# EAGLE design SIM900-SMS-Relay-Controller (EAGLE 6.3)
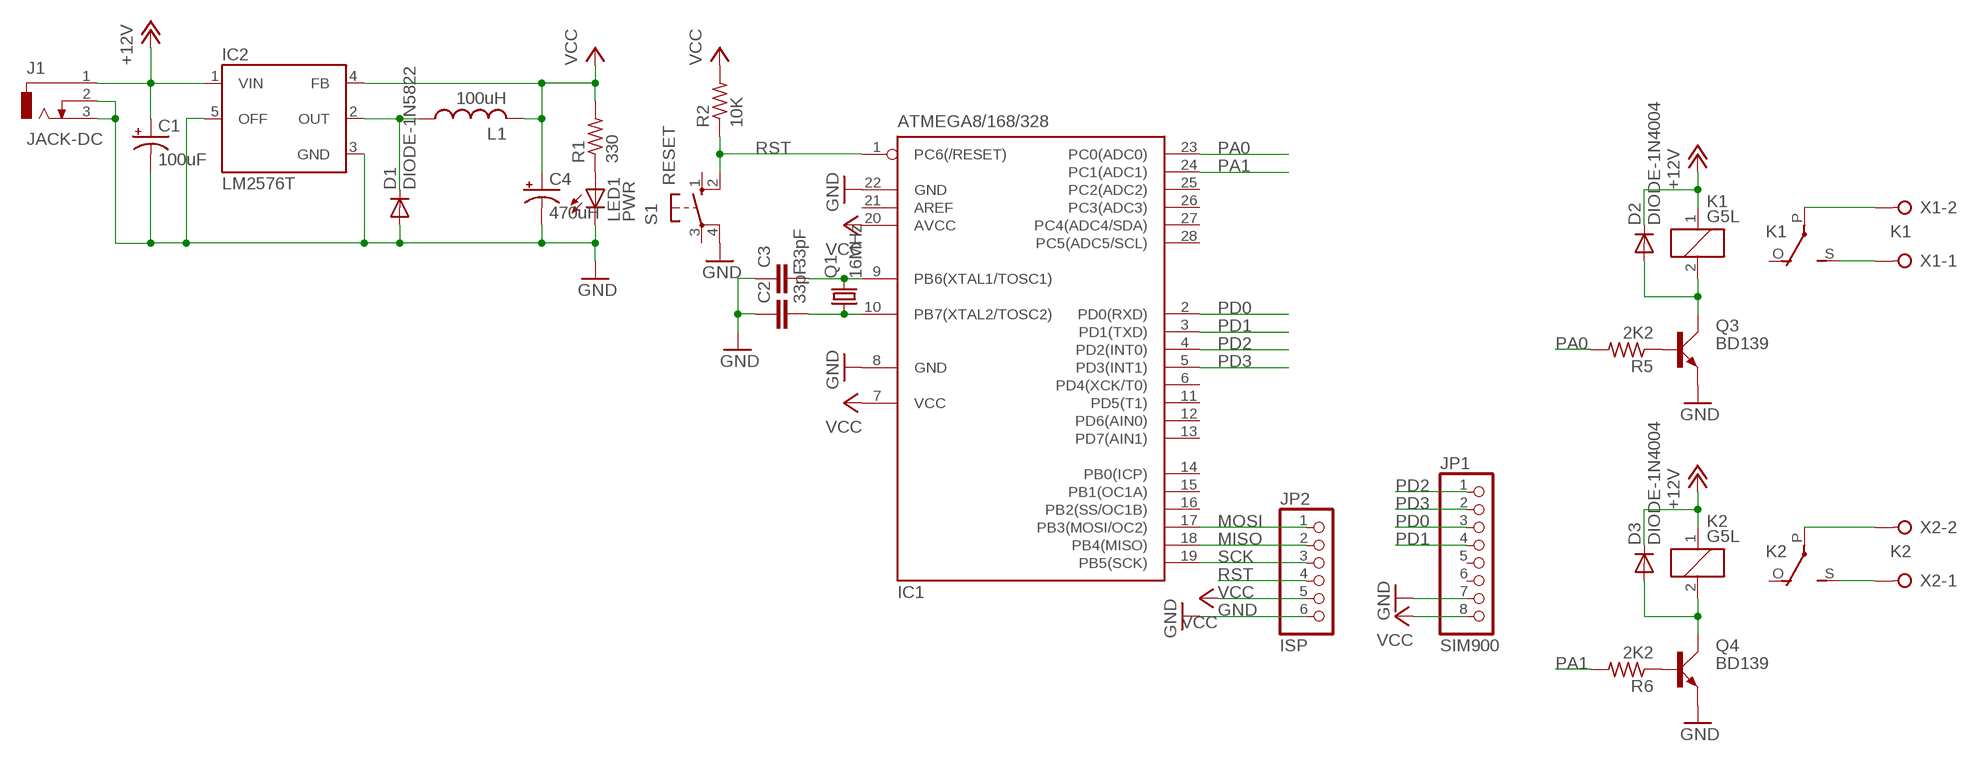
[diagram p0: schematic, sheet 1]

## Parts
C1  100uF  CAPACITOR-POLARE2.5-6  [E2,5-6]
C2  33pF  CAPACITOR-NONPOLAR025-024X044  [C025-024X044]
C3  33pF  CAPACITOR-NONPOLAR025-024X044  [C025-024X044]
C4  470uH  CAPACITOR-POLARE3.5-8  [E3,5-8]
D1  DIODE-1N5822  [DO201-15]
D2  DIODE-1N4004  [DO41-10]
D3  DIODE-1N4004  [DO41-10]
IC1  ATMEGA8/168/328  [DIL28-3]
IC2  LM2576T  [TO220-5]
J1  JACK-DC  [DCJ0202]
JP1  SIM900  PINHD-1X8  [1X08]
JP2  ISP  PINHD-1X6  [1X06]
K1  G5L  [G5LE]
K2  G5L  [G5LE]
L1  100uH  INDUCTORTJ3-U2  [TJ3-U2]
LED1  PWR  LED3MM  [LED3MM]
Q1  16MHz  CRYSTALHC49S  [HC49/S]
Q3  BD139  [TO126AV]
Q4  BD139  [TO126AV]
R1  330  RESISTOR0207/10  [0207/10]
R2  10K  RESISTOR0207/10  [0207/10]
R5  2K2  RESISTOR0207/10  [0207/10]
R6  2K2  RESISTOR0207/10  [0207/10]
S1  RESET  SW-PUSHBUTTON  [B3F-10XX]
X1  K1  W237-02P  [W237-132]
X2  K2  W237-02P  [W237-132]

## Nets
+12V: C1.+ D2.C D3.C IC2.1(VIN) J1.1 K1.1 K2.1
GND: C1.- C2.1 C3.1 C4.- D1.A IC1.8(GND) IC1.22(GND) IC2.3(GND) IC2.5(OFF) J1.2 J1.3 JP1.7 JP2.6 LED1.K(C) Q3.E Q4.E S1.4(P1)
MISO: IC1.18(PB4(MISO)) JP2.2
MOSI: IC1.17(PB3(MOSI/OC2)) JP2.1
N$1: C3.2 IC1.9(PB6(XTAL1/TOSC1)) Q1.2
N$2: C2.2 IC1.10(PB7(XTAL2/TOSC2)) Q1.1
N$3: K1.S(2:S) X1.1
N$6: D1.C IC2.2(OUT) L1.1
N$9: Q3.B R5.1
N$10: LED1.A R1.1
N$11: Q4.B R6.1
N$14: D2.A K1.2 Q3.C
N$15: D3.A K2.2 Q4.C
N$17: K1.P(2:P) X1.2
N$18: K2.S(2:S) X2.1
N$19: K2.P(2:P) X2.2
PA0: IC1.23(PC0(ADC0)) R5.2
PA1: IC1.24(PC1(ADC1)) R6.2
PD0: IC1.2(PD0(RXD)) JP1.3
PD1: IC1.3(PD1(TXD)) JP1.4
PD2: IC1.4(PD2(INT0)) JP1.1
PD3: IC1.5(PD3(INT1)) JP1.2
RST: IC1.1(PC6(/RESET)) JP2.4 R2.1 S1.2(S1)
SCK: IC1.19(PB5(SCK)) JP2.3
VCC: C4.+ IC1.7(VCC) IC1.20(AVCC) IC2.4(FB) JP1.8 JP2.5 L1.2 R1.2 R2.2
Unconnected: IC1.6(PD4(XCK/T0)) IC1.11(PD5(T1)) IC1.12(PD6(AIN0)) IC1.13(PD7(AIN1)) IC1.14(PB0(ICP)) IC1.15(PB1(OC1A)) IC1.16(PB2(SS/OC1B)) IC1.21(AREF) IC1.25(PC2(ADC2)) IC1.26(PC3(ADC3)) IC1.27(PC4(ADC4/SDA)) IC1.28(PC5(ADC5/SCL)) JP1.5 JP1.6 K1.O(2:O) K2.O(2:O) S1.1(S) S1.3(P)

## Library data of the parts
C1 C4 = barelang-store:CAPACITOR-POLAR: POLARIZED CAPACITOR, American symbol
C2 C3 = barelang-store:CAPACITOR-NONPOLAR: CAPACITOR, European symbol
D1 = barelang-store:DIODE-1N5822: DIODE standard rectifier, 3 A, 50 V (Motorola)
D2 D3 = barelang-store:DIODE-1N4004: DIODE general purpose rectifier, 1 A
IC1 = barelang-store:ATMEGA8/168/328: MICROCONTROLLER 8 Kbytes FLASH, 1 kbytes SRAM, 512 bytes EEPROM, USART, 4-channel 10 bit ADC, 2-channel 8 bit ADC Pin compatible with Atmega48, ATMega88, ATMega168 Source: avr.lbr; OC_FARNELL: unknown; OC_NEWARK: unknown
IC2 = barelang-store:LM2576: National Semiconductor <http://www.national.com> 3.0A "Simple Switcher"(c) 52kHz, Vout 1.23-37V (HV: 57V), Vin 40V (HV: 60V), 50µA standby current
J1 = barelang-store:JACK-DC: DC POWER JACK Source: DCJ0202.pdf; OC_FARNELL: unknown; OC_NEWARK: unknown
JP1 = barelang-store:PINHD-1X8: PIN HEADER
JP2 = barelang-store:PINHD-1X6: PIN HEADER
K1 K2 = relay:G5L: RELAY 1 x switch, 10 A/120 V AC, 8 A/30 V ADC, Omron; OC_FARNELL: unknown; OC_NEWARK: unknown
L1 = barelang-store:INDUCTOR: INDUCTOR, American symbol
LED1 = barelang-store:LED: LED OSRAM: - CHIPLED LG R971, LG N971, LY N971, LG Q971, LY Q971, LO R971, LY R971 LH N974, LH R974 LS Q976, LO Q976, LY Q976 LO Q996 - Hyper CHIPLED LW Q18S LB Q993, LB Q99A, LB R99A - SideLED LS A670, LO A670, LY A670, LG A670, LP A670 LB A673, LV A673, LT A673, LW A673 LH A674 LY A675 LS A676, LA A676, LO A676, LY A676, LW A676 LS A679, LY A679, LG A679 - Hyper Micro SIDELED® LS Y876, LA Y876, LO Y876, LY Y876 LT Y87S - SmartLED LW L88C, LW L88S LB L89C, LB L89S, LG L890 LS L89K, LO L89K, LY L89K LS L896, LA L896, LO L896, LY L896 - TOPLED LS T670, LO T670, LY T670, LG T670, LP T670 LSG T670, LSP T670, LSY T670, LOP T670, LYG T670 LG T671, LOG T671, LSG T671 LB T673, LV T673, LT T673, LW T673 LH T674 LS T676, LA T676, LO T676, LY T676, LB T676, LH T676, LSB T676, LW T676 LB T67C, LV T67C, LT T67C, LS T67K, LO T67K, LY T67K, LW E67C LS E67B, LA E67B, LO E67B, LY E67B, LB E67C, LV E67C, LT E67C LW T67C LS T679, LY T679, LG T679 LS T770, LO T770, LY T770, LG T770, LP T770 LB T773, LV T773, LT T773, LW T773 LH T774 LS E675, LA E675, LY E675, LS T675 LS T776, LA T776, LO T776, LY T776, LB T776 LHGB T686 LT T68C, LB T68C - Hyper Mini TOPLED® LB M676 - Mini TOPLED Santana® LG M470 LS M47K, LO M47K, LY M47K Source: http://www.osram.convergy.de LUXEON: - LUMILED® LXK2-PW12-R00, LXK2-PW12-S00, LXK2-PW14-U00, LXK2-PW14-V00 LXK2-PM12-R00, LXK2-PM12-S00, LXK2-PM14-U00 LXK2-PE12-Q00, LXK2-PE12-R00, LXK2-PE12-S00, LXK2-PE14-T00, LXK2-PE14-U00 LXK2-PB12-K00, LXK2-PB12-L00, LXK2-PB12-M00, LXK2-PB14-N00, LXK2-PB14-P00, LXK2-PB14-Q00 LXK2-PR12-L00, LXK2-PR12-M00, LXK2-PR14-Q00, LXK2-PR14-R00 LXK2-PD12-Q00, LXK2-PD12-R00, LXK2-PD12-S00 LXK2-PH12-R00, LXK2-PH12-S00 LXK2-PL12-P00, LXK2-PL12-Q00, LXK2-PL12-R00 Source: www.luxeon.com KINGBRIGHT: KA-3528ASYC Source: www.kingbright.com
Q1 = barelang-store:CRYSTAL: CRYSTAL; OC_FARNELL: 1667008; OC_NEWARK: unknown
Q3 Q4 = barelang-store:BD139: NPN TRANSISTOR
R1 R2 R5 R6 = barelang-store:RESISTOR: RESISTOR, American symbol
S1 = barelang-store:SW-PUSHBUTTON: OMRON SWITCH; MPN: B3F-1000; OC_FARNELL: 176432; OC_NEWARK: 36M3542
X1 X2 = con-wago-508:W237-02P: WAGO SREW CLAMP; OC_FARNELL: unknown; OC_NEWARK: unknown

## Board
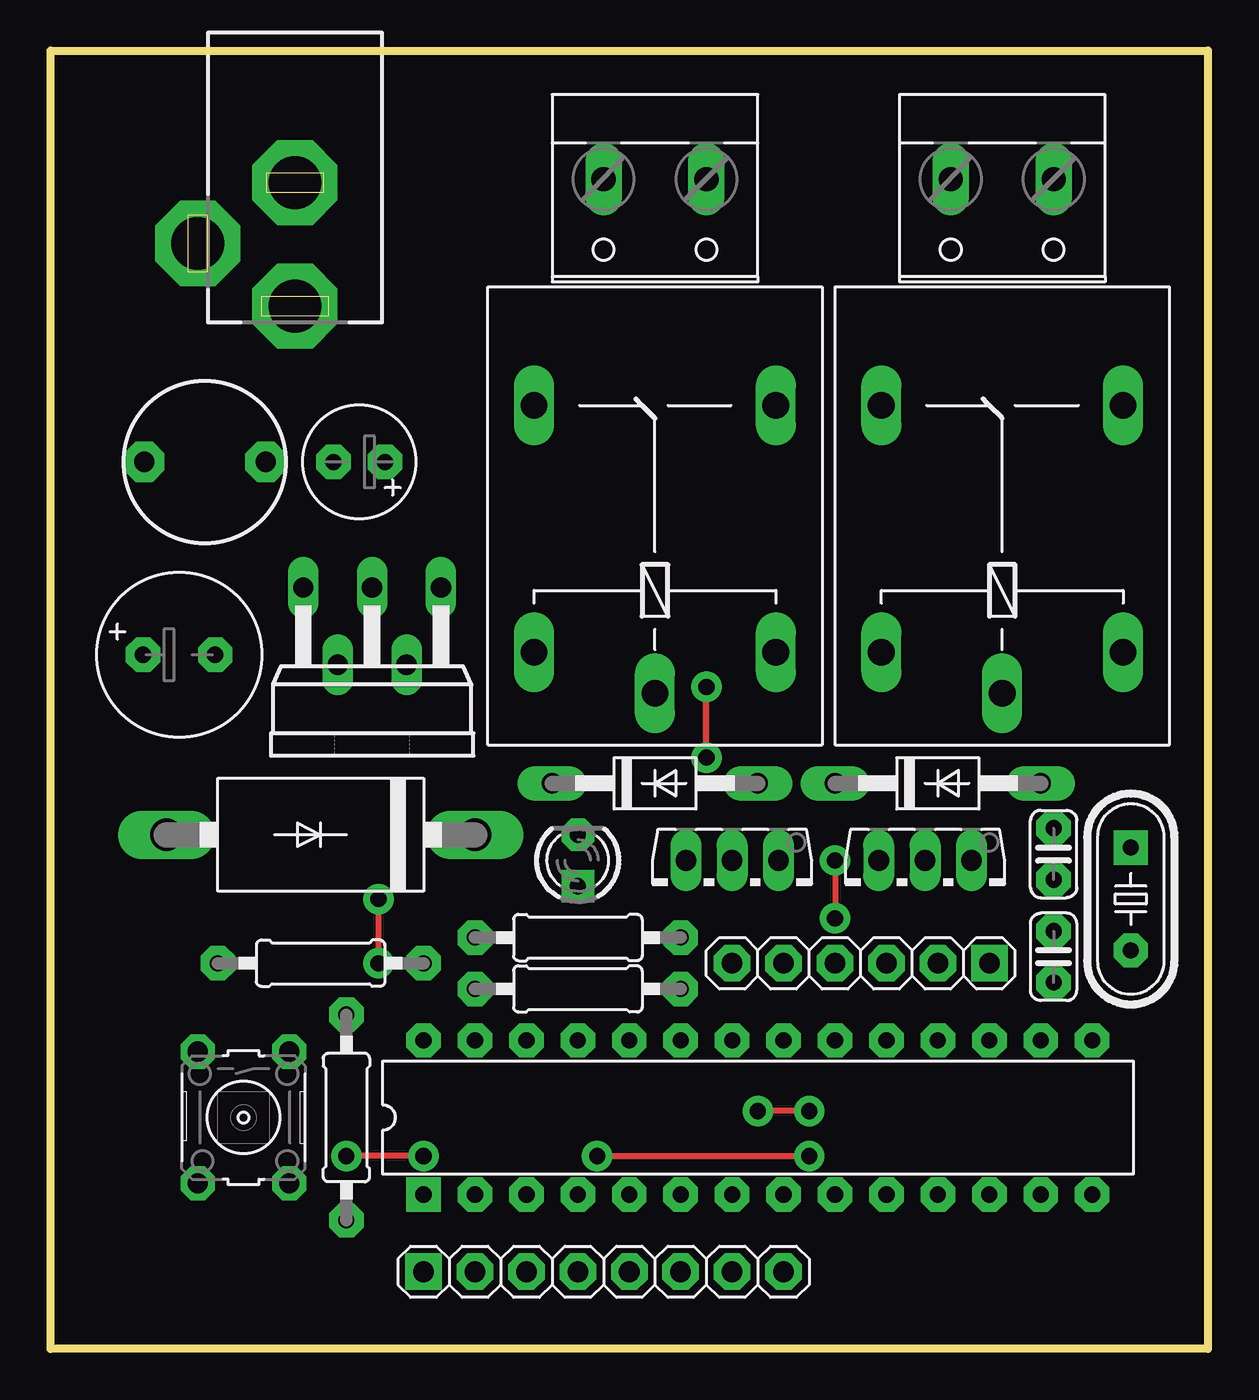
[diagram p1: board, top side]
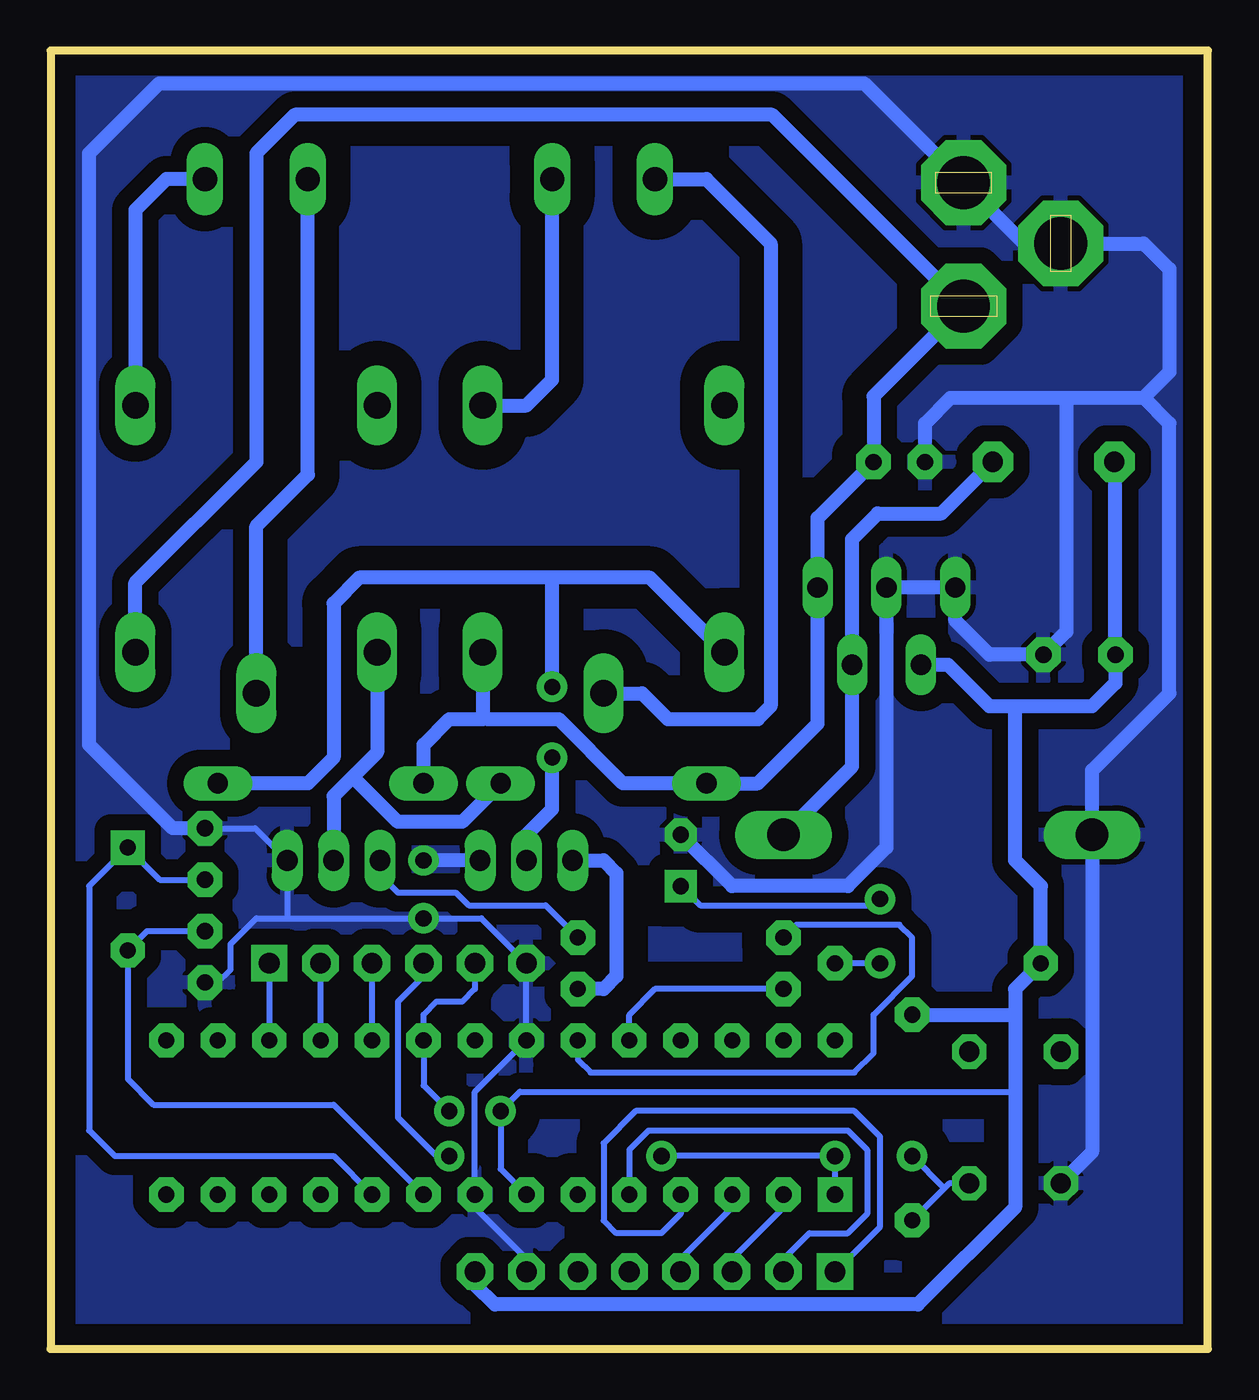
[diagram p2: board, bottom side, seen from below]

Size 57.15 x 64.14 mm. Coordinates in mm from the lower left corner, seen from the top.
Outline: 0,64.14 57.15,64.14 57.15,0 0,0 0,64.14
Copper layers (1*16): Top 0.035mm / dielectric 1.5mm / Bottom 0.035mm
Design rules "default *": minimum track width 0.3mm, minimum drill 0.8mm, track to track 10mil, track to pad 10mil, pad to pad 10mil, via to via 10mil, smd to smd 8mil, copper to edge 40mil, drill to drill 8mil, minimum pad ring 10mil, minimum via ring 8mil, stop-mask expansion 4mil, vias tented up to drill 0mil, thermal gap 10mil

### Footprints (pad centres in the part's own frame; a part is rotated, then mirrored left to right if it is on the bottom)
E2,5-6 = drill 0.8 pad 1.7 octagon: + -1.27,0; - 1.27,0
C025-024X044 = drill 0.8 pad 1.7 octagon: 1 -1.27,0; 2 1.27,0
E3,5-8 = drill 0.813 pad 1.7 octagon: + -1.778,0; - 1.778,0
DO201-15 = drill 1.6 long: A 7.62,0; C -7.62,0
DO41-10 = drill 1 pad 1.7 long: A 5.08,0; C -5.08,0
DIL28-3 = drill 0.8 pad 1.7 square: 1 -16.51,-3.81 | drill 0.8 pad 1.7 octagon: 2 -13.97,-3.81; 3 -11.43,-3.81; 4 -8.89,-3.81; 5 -6.35,-3.81; 6 -3.81,-3.81; 7 -1.27,-3.81; 8 1.27,-3.81; 9 3.81,-3.81; 10 6.35,-3.81; 11 8.89,-3.81; 12 11.43,-3.81; 13 13.97,-3.81; 14 16.51,-3.81; 15 16.51,3.81; 16 13.97,3.81; 17 11.43,3.81; 18 8.89,3.81; 19 6.35,3.81; 20 3.81,3.81; 21 1.27,3.81; 22 -1.27,3.81; 23 -3.81,3.81; 24 -6.35,3.81; 25 -8.89,3.81; 26 -11.43,3.81; 27 -13.97,3.81; 28 -16.51,3.81
TO220-5 = drill 1 long: 1 -3.4,-8.4; 2 -1.7,-4.59; 3 0,-8.4; 4 1.7,-4.59; 5 3.4,-8.4
DCJ0202 = drill 2.6 pad 4.2 octagon: 1 0,3.1; 2 4.8,0; 3 0,-3
1X08 = drill 1.016 pad 1.8 square: 1 -8.89,0 | drill 1.016 pad 1.8 octagon: 2 -6.35,0; 3 -3.81,0; 4 -1.27,0; 5 1.27,0; 6 3.81,0; 7 6.35,0; 8 8.89,0
1X06 = drill 1.016 pad 1.8 square: 1 -6.35,0 | drill 1.016 pad 1.8 octagon: 2 -3.81,0; 3 -1.27,0; 4 1.27,0; 5 3.81,0; 6 6.35,0
G5LE = drill 1.321 long: 1 -7.493,-5.969; 2 -7.493,5.969; O 4.699,5.969; P -9.525,0; S 4.699,-5.969
TJ3-U2 = drill 1 pad 2 octagon: 1 -3,0; 2 3,0
LED3MM = drill 0.8 pad 1.6 square: A -1.27,0 | drill 0.8 pad 1.6 octagon: K 1.27,0
HC49/S = drill 0.8 pad 1.7 square: 1 -2.54,0 | drill 0.8 pad 1.7 octagon: 2 2.54,0
TO126AV = drill 1.016 long: B 2.286,-1.27; C 0,-1.27; E -2.286,-1.27
0207/10 = drill 0.8 pad 1.7 octagon: 1 -5.08,0; 2 5.08,0
B3F-10XX = drill 1 pad 1.7 octagon: 1 -3.251,2.261; 2 3.251,2.261; 3 -3.251,-2.261; 4 3.251,-2.261
W237-132 = drill 1.194 long: 1 -2.54,-0.635; 2 2.54,-0.635

### Placement (x,y rotation side)
C1  15.24,43.81 180 top
C2  49.53,24.45 270 top
C3  49.53,19.37 90 top
C4  6.35,34.29 0 top
D1  13.34,25.4 180 top
D2  29.85,27.94 0 top
D3  43.81,27.94 0 top
IC1  34.93,11.43 0 top
IC2  15.88,29.21 180 top
J1  12.07,54.61 180 top
JP1  27.3,3.81 0 top
JP2  40.01,19.05 180 top
K1  46.99,41.91 90 top
K2  29.85,41.91 90 top
L1  7.62,43.81 180 top
LED1  26.04,24.13 90 top
Q1  53.34,22.23 270 top
Q3  43.18,22.86 180 top
Q4  33.66,22.86 180 top
R1  13.34,19.05 180 top
R2  14.61,11.43 90 top
R5  26.04,20.32 180 top
R6  26.04,17.78 180 top
S1  9.53,11.43 270 top
X1  46.99,57.15 180 top
X2  29.85,57.15 180 top

### Tracks (layer width: path | path; a pad name or v marks a point on that pad's centre or on a via)
+12V
  Bottom 0.3: 35.81,31.12 35.56,31.12
  Bottom 0.7: K1.1 52.96,37.85 46.99,43.81 46.99,59.06 45.09,60.96 21.52,60.96 J1.1 16.51,47.06 C1.+ 19.28,41.05 IC2.1 19.28,30.89 22.23,27.94 D2.C 28.89,27.94 32.07,31.12 35.56,31.12 | D3.C 38.73,29.84 37.47,31.12 35.81,31.12 K2.1
GND  (via drill 0.8 pad 1.5)
  Top 0.3: v38.73,24.13 v38.73,21.27
  Bottom 0.3: 45.47,21.27 46.99,21.27 48.26,20 48.26,18.73 48.9,18.1 C3.1 | 45.47,21.27 v38.73,21.27 35.88,21.27 JP2.6 IC1.22 36.2,12.7 IC1.8 36.2,6.98 33.66,4.45 JP1.7 | C2.1 47.05,25.72 Q3.E 45.47,21.27
  Bottom 0.7: LED1.K 23.5,22.86 17.78,22.86 15.88,24.77 IC2.3 IC2.5 12.48,35.97 10.8,34.29 C4.- 6.98,35.43 6.98,46.99 | C2.1 51.12,25.72 55.25,29.84 55.25,59.06 51.78,62.52 16.98,62.52 J1.3 9.07,54.61 J1.2 3.18,54.61 1.91,53.34 1.91,48.26 3.18,46.99 | 3.18,46.99 1.91,45.72 1.91,32.38 5.72,28.58 D1.A 5.72,9.73 S1.4 | C1.- 13.97,45.72 12.7,46.99 6.98,46.99 | 6.98,46.99 3.18,46.99 | Q4.E v38.73,24.13
  pour Bottom (isolate 0.8): 0,0 57.15,0 57.15,64.14 0,64.14
MISO
  Bottom 0.3: IC1.18 JP2.2
MOSI
  Bottom 0.3: JP2.1 IC1.17
N$1
  Bottom 0.3: IC1.9 43.18,12.06 52.07,12.06 53.34,13.34 Q1.2 52.39,20.64 C3.2
N$2
  Bottom 0.3: IC1.10 43.18,9.52 53.98,9.52 55.25,10.8 55.25,22.86 Q1.1 51.75,23.18 C2.2
N$3
  Bottom 0.7: X1.1 51.44,57.78 52.96,56.26 K1.S
N$4
  pour Bottom (isolate 1.2): 0,0 57.15,0 57.15,64.14 0,64.14
N$6
  Bottom 0.7: L1.1 13.16,41.28 16.3,41.28 17.58,40.01 IC2.2 17.58,28.78 D1.C
N$9
  Bottom 0.3: Q3.B 40.89,23.43 40.01,22.54 37.15,22.54 36.51,21.91 32.7,21.91 R5.1
N$10  (via drill 0.8 pad 1.5)
  Top 0.3: v16.19,19.05 v16.19,22.23
  Bottom 0.3: v16.19,19.05 R1.1 | LED1.A 25.08,21.91 16.51,21.91 v16.19,22.23
N$11
  Bottom 0.7: Q4.B 29.85,24.13 29.21,23.49 29.21,18.41 29.85,17.78 R6.1
N$14
  Bottom 0.7: D2.A 36.83,26.04 40.01,26.04 42.23,28.26 | Q3.C 43.18,27.3 42.23,28.26 | K1.2 41.02,29.46 42.23,28.26
N$15  (via drill 0.8 pad 1.5)
  Top 0.3: v32.39,29.21 v32.39,32.7
  Bottom 0.7: 32.39,38.1 27.56,38.1 K2.2 | 32.39,38.1 41.91,38.1 43.18,36.83 43.18,29.21 44.45,27.94 D3.A | Q4.C 33.66,25.4 32.39,26.67 v32.39,29.21 | v32.39,32.7 32.39,38.1
N$17
  Bottom 0.7: X1.2 44.45,43.18 46.99,40.64 K1.P
N$18
  Bottom 0.7: K2.S 33.66,46.61 32.39,47.88 X2.1
N$19
  Bottom 0.7: X2.2 24.77,57.78 21.59,54.61 21.59,31.75 22.23,31.12 26.67,31.12 27.94,32.38 K2.P
PA0
  Bottom 0.3: R5.2 20.32,20.95 15.24,20.95 14.61,20.32 14.61,18.41 16.51,16.51 16.51,14.61 17.46,13.65 30.48,13.65 31.12,14.29 IC1.23
PA1
  Bottom 0.3: R6.2 27.3,17.78 28.58,16.51 IC1.24
PD0
  Bottom 0.3: IC1.2 20.96,6.98 23.5,4.45 JP1.3
PD1
  Bottom 0.3: IC1.3 23.5,6.98 26.04,4.45 JP1.4
PD2
  Bottom 0.3: JP1.1 16.19,6.03 16.19,10.48 17.46,11.75 28.26,11.75 29.85,10.16 29.85,6.35 29.21,5.71 26.99,5.71 26.04,6.67 IC1.4
PD3
  Bottom 0.3: JP1.2 20.96,4.45 19.69,5.71 17.78,5.71 16.83,6.67 16.83,9.84 17.78,10.8 27.62,10.8 28.58,9.84 IC1.5
RST  (via drill 0.8 pad 1.5)
  Top 0.3: v18.42,9.52 v14.61,9.52 | v26.99,9.52 v37.47,9.52
  Bottom 0.3: IC1.1 v18.42,9.52 v26.99,9.52 | v14.61,9.52 13.02,7.94 | S1.2 12.78,8.18 13.02,7.94 | 13.02,7.94 R2.1 | JP2.4 38.73,18.41 40.01,17.15 40.01,11.43 38.1,9.52 v37.47,9.52
SCK
  Bottom 0.3: IC1.19 JP2.3
VCC  (via drill 0.8 pad 1.5)
  Top 0.3: v37.47,11.75 v34.93,11.75
  Bottom 0.3: 9.53,12.7 33.97,12.7 v34.93,11.75 34.93,8.89 IC1.7 | JP2.5 36.2,17.78 36.83,17.15 38.1,17.15 38.73,16.51 IC1.20 38.73,13.02 v37.47,11.75 | 4.57,43.77 L1.2
  Bottom 0.7: 9.53,16.51 9.53,17.78 R1.2 8.26,22.86 9.53,24.13 9.53,31.75 | 9.53,16.51 9.53,12.7 9.53,6.98 14.32,2.19 35.21,2.19 36.2,3.18 JP1.8 | 4.57,43.77 C4.+ 4.57,32.89 5.72,31.75 9.53,31.75 | IC2.4 12.85,33.8 10.8,31.75 9.53,31.75 | R2.2 9.53,16.51